# EAGLE design SNES_RGBAmp (EAGLE 7.0.0)
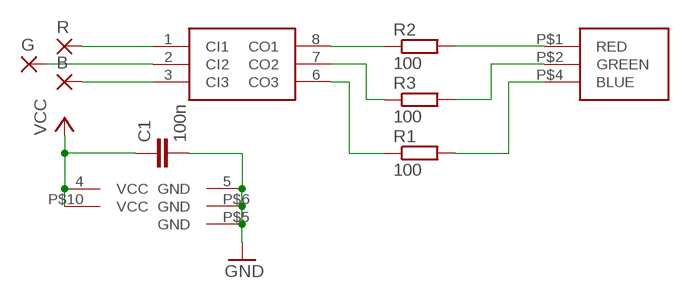
[diagram p0: schematic, sheet 1]

## Parts
B  SMD2  [SMD1,27-2,54]
C1  100n  C0805  [Z0805]
G  SMD2  [SMD1,27-2,54]
R  SMD2  [SMD1,27-2,54]
R1  100  R0805  [Z0805]
R2  100  R0805  [Z0805]
R3  100  R0805  [Z0805]
U$1  THS7314  [THS7314]
U$3  SNES_MULTIAV_RGB_ONLY  [SNES_MULTIAV_RGB_ONLY]

## Nets
GND: C1.2 U$1.5(GND) U$3.P$5(GND) U$3.P$6(GND)
N$1: R.1(P) U$1.1(CI1)
N$2: G.1(P) U$1.2(CI2)
N$3: B.1(P) U$1.3(CI3)
N$4: R2.1 U$1.8(CO1)
N$5: R2.2 U$3.P$1(RED)
N$6: R3.2 U$3.P$2(GREEN)
N$7: R3.1 U$1.7(CO2)
N$8: R1.1 U$1.6(CO3)
N$9: R1.2 U$3.P$4(BLUE)
VCC: C1.1 U$1.4(VCC) U$3.P$10(VCC)

## Library data of the parts
B G R = wirepad:SMD2: SMD PAD
C1 = snescart:C0805
R1-R3 = snescart:R0805
U$1 = snescart:THS7314
U$3 = snes_div:SNES_MULTIAV_RGB_ONLY

## Board
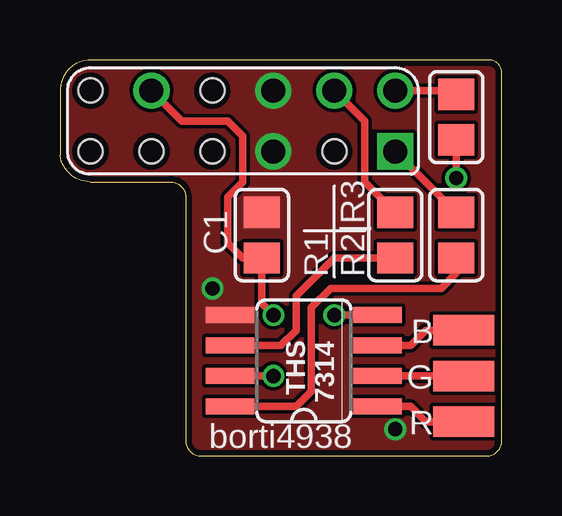
[diagram p1: board, top side]
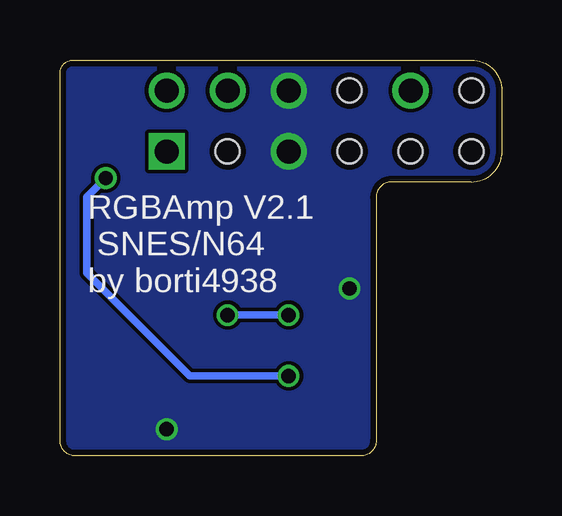
[diagram p2: board, bottom side, seen from below]

Size 18.41 x 16.52 mm. Coordinates in mm from the lower left corner, seen from the top.
Outline: 1.27,11.43 4.6,11.43 arc-90 5.24,10.79 5.24,0.63 arc90 5.87,0 17.78,0 arc90 18.41,0.63 18.41,16.03 arc90 17.78,16.51 1.27,16.51 arc90 0,15.24 0,12.54 arc82 1.27,11.43
Copper layers (1*16): Top 0.035mm / dielectric 1.5mm / Bottom 0.035mm
Design rules "ITEADstudio_DRC": minimum track width 6mil, minimum drill 12mil, track to track 6mil, track to pad 6mil, pad to pad 6mil, via to via 6mil, smd to smd 0mil, copper to edge 10mil, drill to drill 10mil, minimum pad ring 10mil, minimum via ring 6mil, stop-mask expansion 2mil, vias tented up to drill 100mil, thermal gap 10mil

### Footprints (pad centres in the part's own frame; a part is rotated, then mirrored left to right if it is on the bottom)
SMD1,27-2,54 = smd 1.27 x 2.54: 1 0,0
Z0805 = smd 1.3 x 1.5: 1 -0.95,0; 2 0.95,0
THS7314 = smd 0.66 x 2.032: 1 -1.905,-3.073; 2 -0.635,-3.073; 3 0.635,-3.073; 4 1.905,-3.073; 5 1.905,3.073; 6 0.635,3.073; 7 -0.635,3.073; 8 -1.905,3.073
SNES_MULTIAV_RGB_ONLY = drill 1 square: P$1 6.35,-1.27 | drill 1: P$2 6.35,1.27; P$4 3.81,1.27; P$5 1.27,-1.27; P$6 1.27,1.27; P$10 -3.81,1.27 | hole 1: 3.81,-1.27; -1.27,1.27; -1.27,-1.27; -3.81,-1.27; -6.35,-1.27; -6.35,1.27

### Placement (x,y rotation side)
B  16.83,5.24 90 top
C1  8.41,9.21 90 top
G  16.83,3.33 90 top
R  16.83,1.43 90 top
R1  13.97,9.21 90 top
R2  16.51,9.21 90 top
R3  16.51,14.13 90 top
U$1  10.16,3.97 90 top
U$3  7.62,13.97 0 top

### Tracks (layer width: path | path; a pad name or v marks a point on that pad's centre or on a via)
GND  (via drill 0.6)
  other vias: 6.35,6.98 13.97,1.11
  pour Top (no thermals): -2.54,-4.45 21.59,-4.45 21.59,18.41 -2.54,18.41
  pour Bottom (no thermals): -2.54,18.41 21.59,18.41 21.59,-4.45 -2.54,-4.45
N$1
  Top 0.305: U$1.1 14.61,2.06 15.24,1.43 R.1
N$2
  Top 0.305: U$1.2 G.1
N$3
  Top 0.305: U$1.3 14.61,4.6 15.24,5.24 B.1
N$4
  Top 0.305: U$1.8 9.84,2.06 10.48,2.7 10.48,6.19 11.27,6.98 15.88,6.98 16.51,7.62 R2.1
N$5
  Top 0.305: U$3.P$1 R2.2
N$6
  Top 0.305: 16.51,15.24 R3.2 16.35,15.24 U$3.P$2
N$7  (via drill 0.6)
  Top 0.305: U$1.7 v8.89,3.33 | v16.51,11.59 R3.1
  Bottom 0.305: v16.51,11.59 17.3,10.79 17.3,7.62 13.02,3.33 v8.89,3.33
N$8
  Top 0.305: U$1.6 9.21,4.6 9.84,5.24 9.84,6.67 11.43,8.25 R1.1
N$9
  Top 0.305: R1.2 12.7,11.43 12.7,13.97 U$3.P$4
VCC  (via drill 0.6)
  Top 0.305: U$1.4 v11.43,5.87 | v8.89,5.87 8.41,6.35 C1.1 7.62,8.25 6.99,8.89 6.99,10.79 7.62,11.43 7.62,13.34 6.99,13.97 5.08,13.97 U$3.P$10
  Bottom 0.305: v8.89,5.87 v11.43,5.87

### Text on the board
tPlace: C1 | THS / 7314
bPlace: RGBAmp V2.1 / SNES/N64 / by borti4938
tNames: R1 / R2|R3 | borti4938